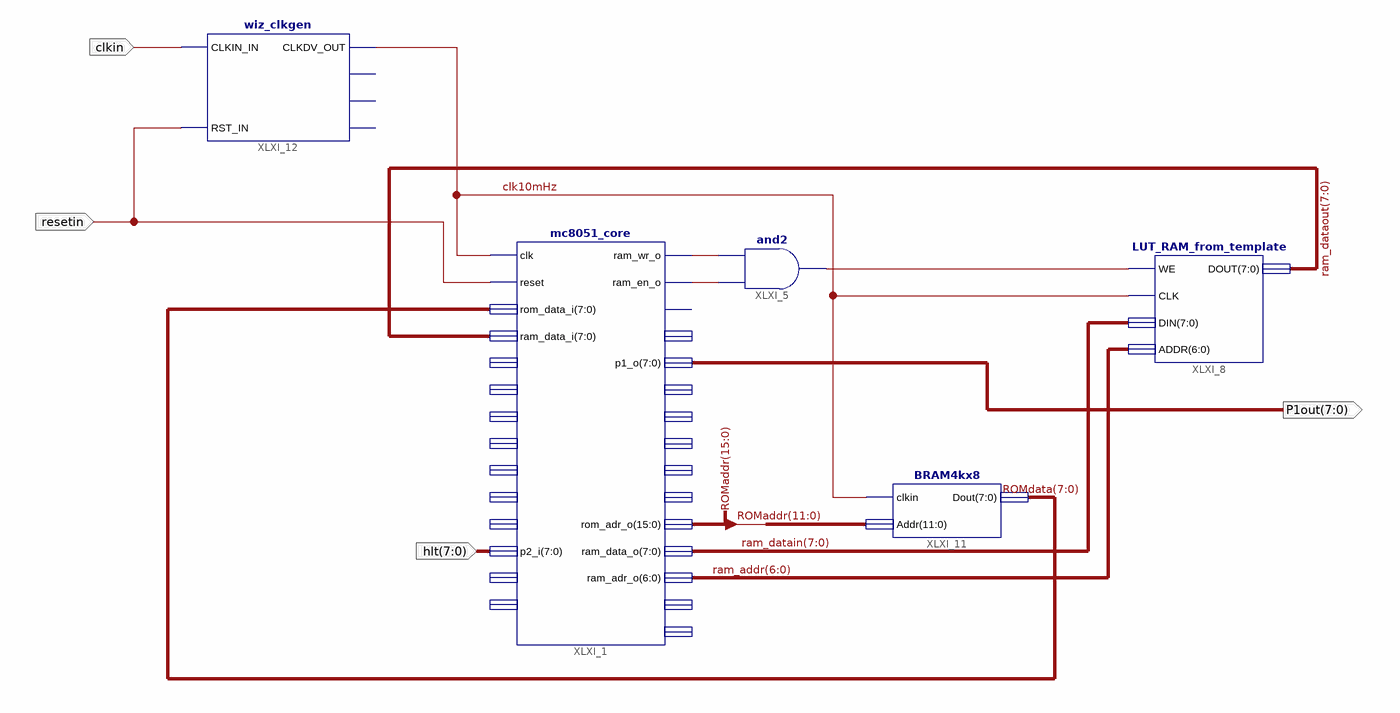
[diagram p0: schematic sheet 1]
// Xilinx ISE schematic top.sch (spartan3e) as structural Verilog: 5 symbols, 4 ports
module top (
  input  resetin,
  input  clkin,
  input  [7:0] hlt,
  output [7:0] P1out
);

  wire clk10mHz, XLXN_9, XLXN_10, XLXN_16;
  wire [6:0] ram_addr;
  wire [7:0] ram_datain, ram_dataout, ROMdata;
  wire [15:0] ROMaddr;

  mc8051_core XLXI_1 (
    .clk(clk10mHz), .reset(resetin), .rom_data_i(ROMdata), .ram_data_i(ram_dataout), .p2_i(hlt),
    .ram_wr_o(XLXN_9), .ram_en_o(XLXN_10), .p1_o(P1out), .rom_adr_o(ROMaddr), .ram_data_o(ram_datain),
    .ram_adr_o(ram_addr));  // open: int0_i, int1_i, all_t0_i, all_t1_i, all_rxd_i, p0_i, p1_i, p3_i, datax_i, wrx_o, p0_o, p2_o, p3_o, all_rxd_o, all_txd_o, all_rxdwr_o, datax_o, adrx_o
  and XLXI_5 (XLXN_16, XLXN_10, XLXN_9);
  LUT_RAM_from_template XLXI_8 (.WE(XLXN_16), .CLK(clk10mHz), .DIN(ram_datain), .ADDR(ram_addr), .DOUT(ram_dataout));
  BRAM4kx8 XLXI_11 (.clkin(clk10mHz), .Addr(ROMaddr[11:0]), .Dout(ROMdata));
  wiz_clkgen XLXI_12 (
    .CLKIN_IN(clkin), .RST_IN(resetin), .CLKDV_OUT(clk10mHz));  // open: CLKIN_IBUFG_OUT, CLK0_OUT, LOCKED_OUT
endmodule
